# EAGLE design Qwiic_I2C_Capacitor (EAGLE 9.4.2)
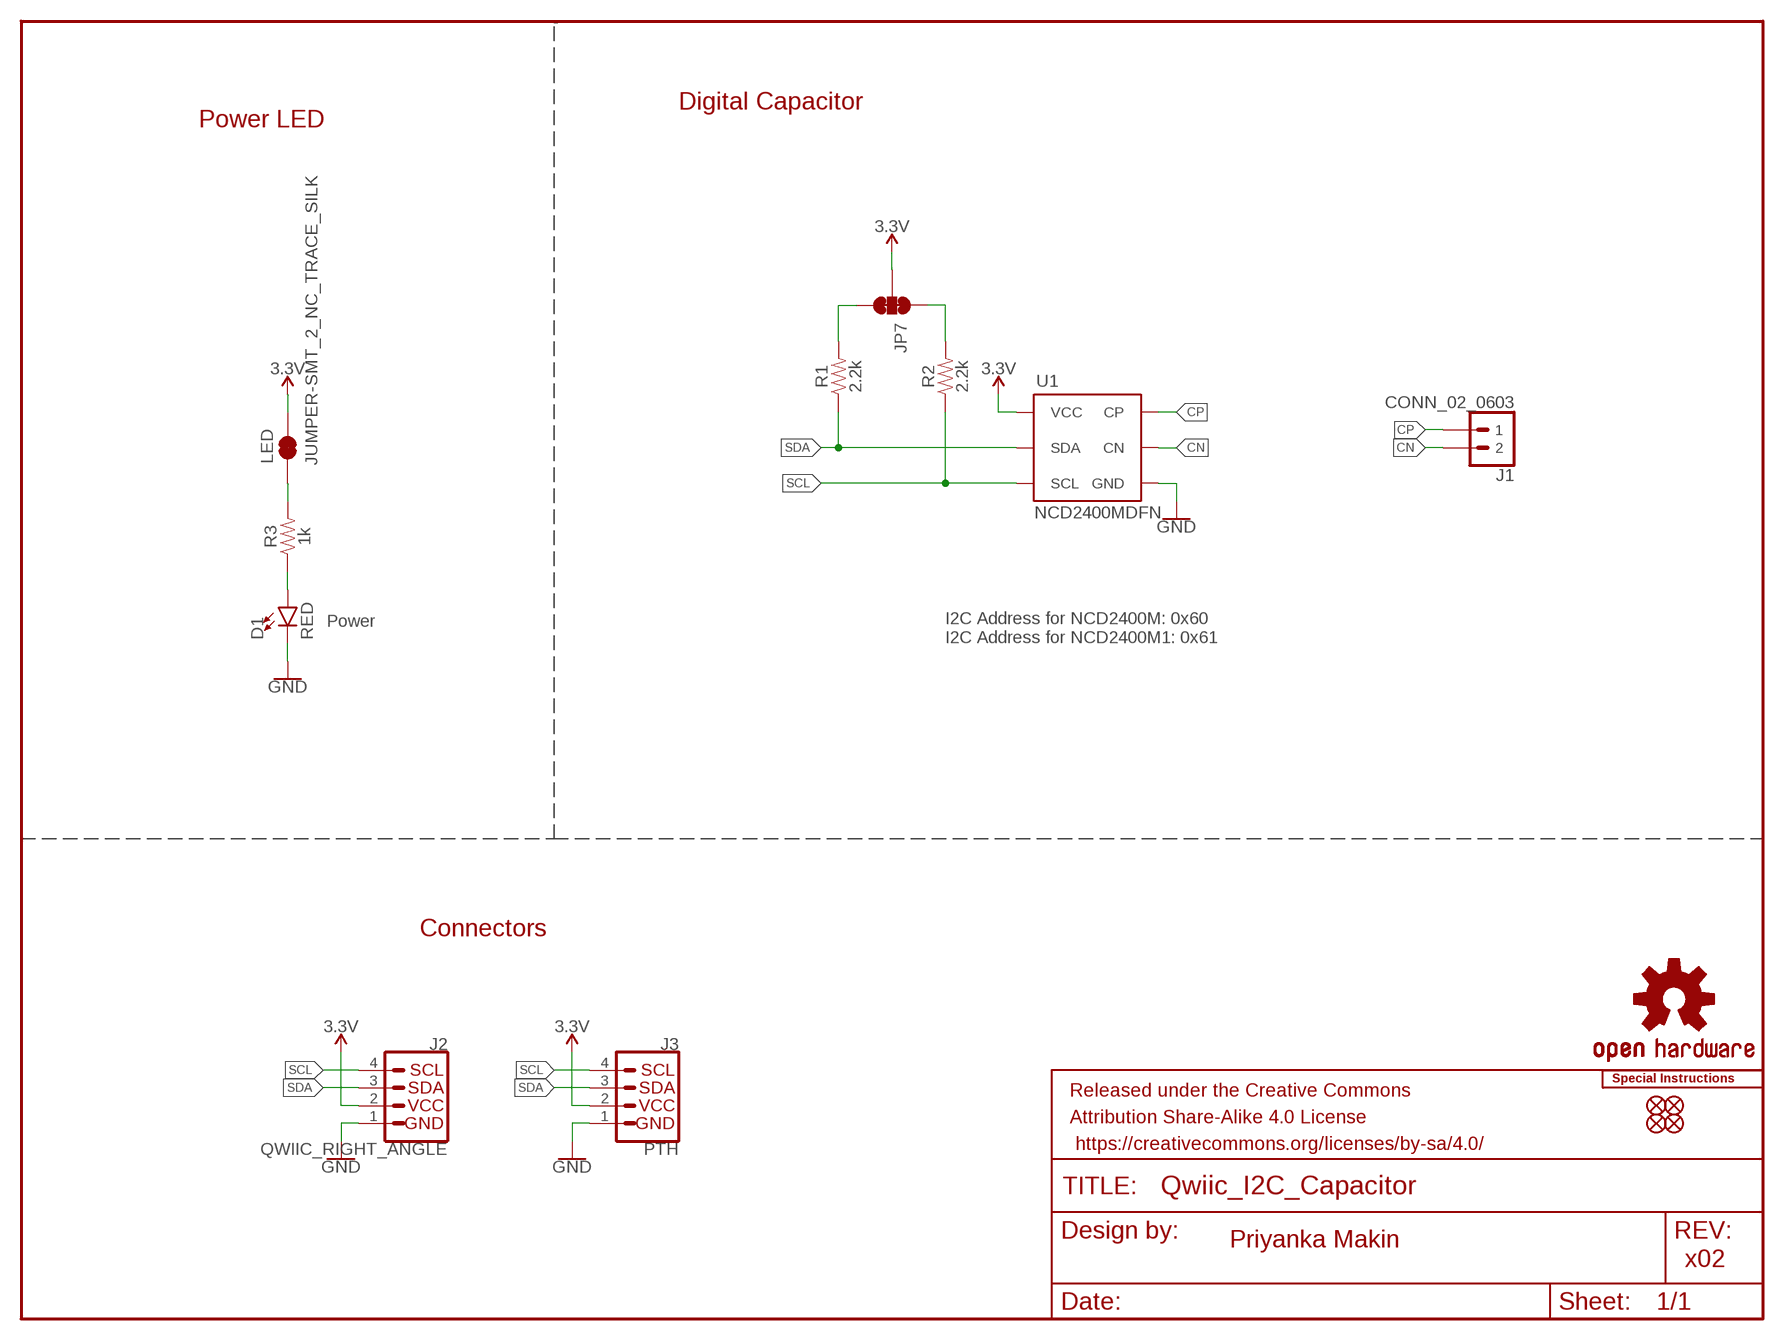
[diagram p0: schematic, sheet 1]

## Parts
D1  RED  LED-RED0603  [LED-0603]
FRAME1  FRAME-LETTER  [CREATIVE_COMMONS]
J1  CONN_02_0603  [0603_CASTELLATED]
J2  QWIIC_RIGHT_ANGLE  QWIIC_CONNECTORJS-1MM  [JST04_1MM_RA]
J3  PTH  I2C_STANDARD_NO_SILK  [1X04_NO_SILK]
JP1  FIDUCIAL0.2MM  [FIDUCIAL-0.2MM]
JP2  FIDUCIAL0.2MM  [FIDUCIAL-0.2MM]
JP5  FIDUCIAL0.2MM  [FIDUCIAL-0.2MM]
JP6  FIDUCIAL0.2MM  [FIDUCIAL-0.2MM]
JP7  JUMPER-SMT_3_2-NC_TRACE_SILK  [SMT-JUMPER_3_2-NC_TRACE_SILK]
LED  JUMPER-SMT_2_NC_TRACE_SILK  [SMT-JUMPER_2_NC_TRACE_SILK]
LOGO1  OSHW-LOGOMINI  [OSHW-LOGO-MINI]
LOGO2  SPECIAL_INSTRUCTIONS-ORDERING  [ORDERING_INSTRUCTIONS]
R1  2.2k  2.2KOHM-0603-1/10W-1%  [0603]
R2  2.2k  2.2KOHM-0603-1/10W-1%  [0603]
R3  1k  1KOHM-0603-1/10W-1%  [0603]
U1  NCD2400MDFN  [DFN6]

## Nets
3.3V: J2.2 J3.2(VCC) JP7.2 LED.2 U1.4(VCC)
CN: J1.2 U1.3(CN)
CP: J1.1 U1.2(CP)
GND: D1.C J2.1 J3.1(GND) U1.5(GND)
N$1: JP7.3 R1.2
N$2: JP7.1 R2.2
N$3: D1.A R3.1
N$4: LED.1 R3.2
SCL: J2.4 J3.4(SCL) R2.1 U1.6(SCL)
SDA: J2.3 J3.3(SDA) R1.1 U1.1(SDA)

## Notes on the sheet
- Digital Capacitor
- Power LED
- Power
- I2C Address for NCD2400M: 0x60
  I2C Address for NCD2400M1: 0x61
- Connectors
- Priyanka Makin
- x02

## Library data of the parts
D1 = SparkFun-LED:LED-RED: Red SMD LED Used in manufacturing of most products at SparkFun Packages: 0603 - SMD 0603 package [Product Link] <http://docs.avagotech.com/docs/AV02-0551EN> 0603 SMART - SMD 0603 SMART package ( more efficient and expensive)[Product Link] <http://www.osram-os.com/Graphics/XPic2/00077099_0.pdf> 1206 - SMD1206 package [Product Link] <https://www.sparkfun.com/datasheets/DevTools/LilyPad/Q150OVS4.pdff> SparkFun Products: Pro Mini 328 -5V <https://www.sparkfun.com/products/821> RedBoard <https://www.sparkfun.com/products/12757> IOIO-OTG <https://www.sparkfun.com/products/13613>; PROD_ID: DIO-00819
FRAME1 = SparkFun-Aesthetics:FRAME-LETTER: Schematic Frame - Letter Standard 8.5x11 US Letter frame
J1 = Qwiic_Capacitor:CONN_02_0603
J2 = SparkFun-Connectors:QWIIC_CONNECTOR: SparkFun I2C Standard Qwiic Connector An SMD 1mm pitch JST connector makes it easy and quick (get it? Qwiic?) to connect I2C devices to each other. The Qwiic system <http://www.sparkfun.com/qwiic> enables fast and solderless connection between popular platforms and various sensors and actuators. We carry 200mm <https://www.sparkfun.com/products/14204>, 100mm <https://www.sparkfun.com/products/14205>, 50mm <https://www.sparkfun.com/products/14206>, and breadboard friendly <https://www.sparkfun.com/products/14207> Qwiic cables. We also offer 10 pcs strips <https://www.sparkfun.com/products/14323> the SMD connectors.; PROD_ID: CONN-13694
J3 = SparkX:I2C_STANDARD: SparkFun I2C Standard Pinout Header SparkFun has standardized on a pinout for all I2C based sensor breakouts. This pinout allows I2C boards to be plugged directly into the headers on Arduino Uno compatible boards, and to be daisy chained easily. Example SparkFun Products: SparkFun Atmospheric Sensor Breakout - BME280 <https://www.sparkfun.com/products/13676> SparkFun Altitude/Pressure Sensor Breakout - MPL3115A2 <https://www.sparkfun.com/products/11084> SparkFun TOF Range Finder Sensor - VL6180 <https://www.sparkfun.com/products/12785>
JP1 JP2 JP5 JP6 = SparkFun-Aesthetics:FIDUCIAL: Fiducial Alignment Points Point-of-reference for pick-and-place machines and other optical instruments.
JP7 = SparkFun-Jumpers:JUMPER-SMT_3_2-NC_TRACE: Normally closed trace jumper (2 of 2 connections) This jumper has a trace between all three pads so they are normally closed (NC). Use a razor knife to open the connection(s). For best results follow the IPC guidelines for cutting traces: Cutout at least 0.063 mm (0.005 in). Remove all loose material to clean up the cut area. Seal the cut with an approved epoxy. Reapply solder to reclose the connection(s).
LED = SparkFun-Jumpers:JUMPER-SMT_2_NC_TRACE: Normally closed trace jumper This jumper has a trace between two pads so it's normally closed (NC). Use a razor knife to open the connection. For best results follow the IPC guidelines for cutting traces: Cutout at least 0.063 mm (0.005 in). Remove all loose material to clean up the cut area. Seal the cut with an approved epoxy. Reapply solder to reclose the connection.
LOGO1 = SparkFun-Aesthetics:OSHW-LOGO: Open-Source Hardware (OSHW) Logo This logo indicates the piece of hardware it is found on incorporates a OSHW license and/or adheres to the definition of open source hardware found here: http://freedomdefined.org/OSHW
LOGO2 = SparkFun-Aesthetics:SPECIAL_INSTRUCTIONS: Special Ordering/Production Instructions Alert Symbol for special PCB ordering instructions or unique production process warnings. Ordering Instructions Production Instructions Types of information that should be added to box: Copper weight Soldermask color Silk color PCB thickness Number of layers PCB Standard: 1.6mm FR4 1 oz copper immersion silver plating red soldermask white silkscreen Types of information that should be added to box: Special wash requirements Depaneling instructions Humidification Glue curing Default text settings: 0.07 inch 9% ratio 50% line distance
R1 R2 = SparkFun-Resistors:2.2KOHM: 2.2kΩ resistor A resistor is a passive two-terminal electrical component that implements electrical resistance as a circuit element. Resistors act to reduce current flow, and, at the same time, act to lower voltage levels within circuits. - Wikipedia; PROD_ID: RES-08272
R3 = SparkFun-Resistors:1KOHM: 1kΩ resistor A resistor is a passive two-terminal electrical component that implements electrical resistance as a circuit element. Resistors act to reduce current flow, and, at the same time, act to lower voltage levels within circuits. - Wikipedia; PROD_ID: RES-07856
U1 = SparkFun-Capacitors:NCD2400M

## Net classes
1 power: width 0.203 mm

## Board
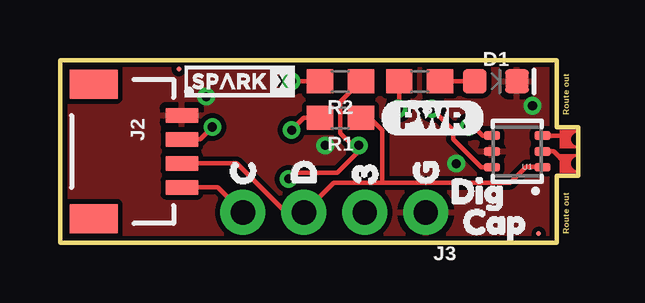
[diagram p1: board, top side]
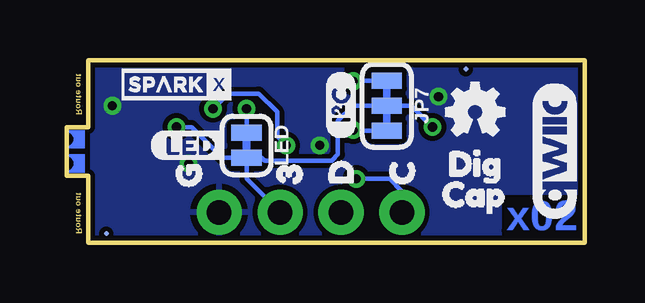
[diagram p2: board, bottom side, seen from below]

Size 21.59 x 7.62 mm. Coordinates in mm from the lower left corner, seen from the top.
Outline: 0,0 20.7,0 20.7,2.79 21.59,2.79 21.59,4.83 20.7,4.83 20.7,7.62 0,7.62 0,0
Copper layers (1*16): Top 0.035mm / dielectric 1.5mm / Bottom 0.035mm
Design rules "SparkFun-2-layer-TIGHT *": minimum track width 7mil, minimum drill 15mil, track to track 7mil, track to pad 7mil, pad to pad 7mil, via to via 7mil, smd to smd 7mil, copper to edge 7mil, drill to drill 7mil, minimum pad ring 0mil, minimum via ring 7mil, stop-mask expansion 4mil, vias tented up to drill 25mil, thermal gap 10mil

### Footprints (pad centres in the part's own frame; a part is rotated, then mirrored left to right if it is on the bottom)
LED-0603 = smd 1 x 1: A -0.877,0; C 0.877,0
0603_CASTELLATED = drill 0.559 pad 0.559: 1 -0.508,0; 2 0.508,0
JST04_1MM_RA = smd 0.6 x 1.35: 1 -1.5,0; 2 -0.5,0; 3 0.5,0; 4 1.5,0 | smd 1.2 x 2: NC1 2.8,-3.675; NC2 -2.8,-3.675
1X04_NO_SILK = drill 1.016 pad 1.88: 1 0,0; 2 2.54,0; 3 5.08,0; 4 7.62,0
FIDUCIAL-0.2MM = smd 0.2 x 0.2: 1 0,0
SMT-JUMPER_3_2-NC_TRACE_SILK = smd 0.66 x 1.27: 1 -1.041,0; 2 0,0; 3 1.041,0
SMT-JUMPER_2_NC_TRACE_SILK = smd 0.66 x 1.27: 1 -0.521,0; 2 0.521,0
0603 = smd 1.1 x 1: 1 -0.85,0; 2 0.85,0
DFN6 = smd 0.66 x 0.356: 1 -1.054,0.66; 2 -1.054,0; 3 -1.054,-0.66; 4 1.054,-0.66; 5 1.054,0; 6 1.054,0.66

### Placement (x,y rotation side)
D1  18.16,6.73 0 top
FRAME1  -12.7,-11.43 0 top  (outside the outline)
J1  21.59,3.81 90 top
J2  5.08,3.81 270 top
J3  15.24,1.27 180 top
JP1  4.95,7.24 0 bottom
JP2  19.94,0.38 0 top
JP5  19.94,0.38 0 bottom
JP6  4.95,7.24 0 top
JP7  8.26,5.71 270 bottom
LED  14.1,4.06 270 bottom
LOGO1  4.57,5.46 0 bottom
LOGO2  31.75,53.34 0 top  (outside the outline)
R1  11.68,5.21 180 top
R2  11.68,6.73 180 top
R3  14.99,6.73 180 top
U1  19.05,3.81 180 top
U$1  [PWR2]  13.34,5.21 0 top
U$3  [32]  12.32,1.52 90 bottom
U$4  [C0]  7.62,1.52 90 bottom
U$5  [D1]  10.16,1.52 90 bottom
U$6  [G3]  16.51,1.4 90 bottom
U$7  [32]  12.7,1.52 90 top
U$8  [C0]  7.62,1.52 90 top
U$9  [I_SUPER2_C-()-03]  10.16,4.32 90 bottom
U$11  [CAP1]  15.88,0.89 0 top
U$12  [SPARKX-TINY]  7.49,6.73 0 top
U$13  [D1]  10.16,1.52 90 top
U$14  [G3]  15.24,1.52 90 top
U$15  [LED0]  18.16,4.06 0 bottom
U$16  [SPARKX-TINY]  17.02,6.6 0 bottom
U$18  [CAP1]  6.86,2.03 0 bottom
U$20  [QWIIC_COPYRIGHT_SMALL]  1.27,3.81 90 bottom
U$21  [QWIIC_COPYRIGHT_SMALL]  1.27,3.81 90 bottom
U$22  [DIG0]  15.37,2.16 0 top
U$23  [DIG0]  6.6,3.3 0 bottom

### Tracks (layer width: path | path; a pad name or v marks a point on that pad's centre or on a via)
3.3V  (via drill 0.38)
  Top 0.178: J2.2 5.83,4.31 v6.35,4.83 | v17.02,4.83 17.26,4.83 17.61,4.47 U1.4
  Bottom 0.178: LED.2 14.1,2.67 J3.2 | v6.35,4.83 7.24,5.71 JP7.2 9.65,5.71 10.29,5.08 10.29,3.68 10.55,3.42 13.34,3.42 13.46,3.54 LED.2 | LED.2 15.1,3.54 16.38,4.83 v17.02,4.83
CN
  Top 0.178: J1.2 21.44,4.47 U1.3
CP
  Top 0.178: J1.1 21.08,3.3 20.57,3.81 U1.2
GND  (via drill 0.38)
  other vias: 6.1,6.1 19.68,5.71 16.51,3.3 11.05,4.06
  pour Bottom (isolate 0.203): 0,0 20.7,0 20.7,2.79 21.59,2.79 21.59,4.83 20.7,4.83 20.7,7.62 0,7.62
  pour Top (isolate 0.203): 0,0 20.7,0 20.7,2.79 21.59,2.79 21.59,4.83 20.7,4.83 20.7,7.62 0,7.62
N$1  (via drill 0.38)
  Top 0.178: v9.65,4.7 10.16,5.21 R1.2
  Bottom 0.178: JP7.3 9.63,4.67 v9.65,4.7
N$2  (via drill 0.38)
  Top 0.178: v9.65,6.73 R2.2
  Bottom 0.178: JP7.1 9.63,6.76 v9.65,6.73
N$3
  Top 0.178: R3.1 D1.A
N$4  (via drill 0.38)
  Top 0.178: R3.2 14.14,5.63 v14.1,5.59
  Bottom 0.178: v14.1,5.59 LED.1
SCL  (via drill 0.38)
  Top 0.178: J2.4 6.58,2.31 J3.4 | v15.49,5.59 16.38,4.7 16.38,4.33 17.56,3.15 U1.6 | v9.53,2.67 9.78,2.92 11.56,2.92 12.45,3.81 v12.45,4.06 12.19,4.06 11.68,4.57 11.68,5.88 R2.1
  Bottom 0.178: J3.4 7.62,2.16 8.13,2.67 v9.53,2.67 | v15.49,5.59 14.86,6.22 13.59,6.22 12.83,5.46 12.83,4.45 v12.45,4.06
SDA
  Top 0.178: J2.3 7.36,3.31 9.4,1.27 J3.3 11.4,2.52 13.42,2.52 | U1.1 20.08,3.17 19.43,3.17 18.77,2.52 13.42,2.52 | R1.1 12.91,5.21 13.42,4.7 13.42,2.52

### Text on the board
Bottom: x02
Dimension: Route out | Route out
Measures: Dimensions in inches
tDocu: 0.8mm board | Priyanka Makin